# EAGLE design main (EAGLE 9.1.1)
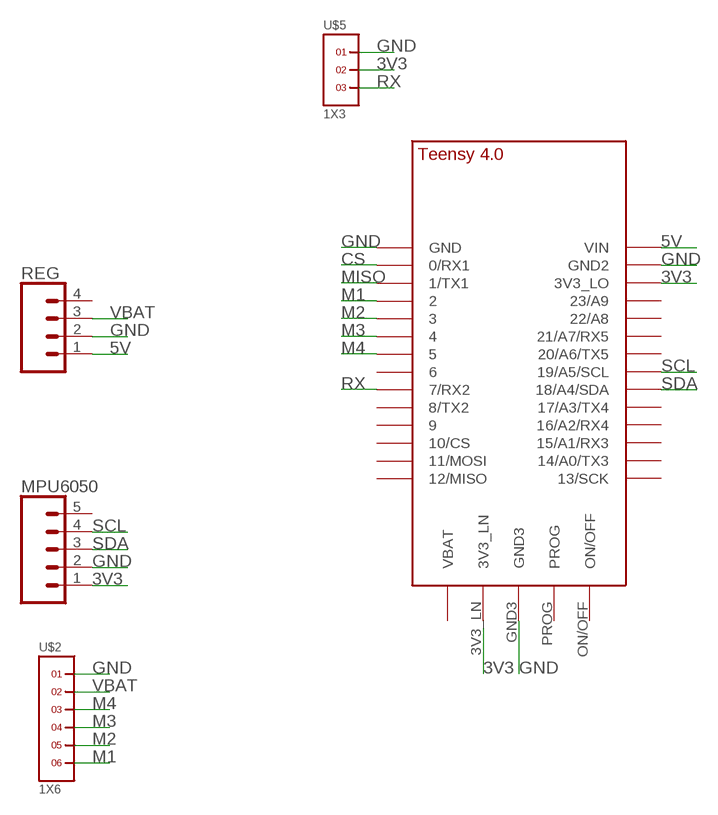
[diagram p0: schematic, sheet 1]

## Parts
MPU6050  CONN_05NO_SILK  [1X05_NO_SILK]
REG  CONN_041X04_NO_SILK  [1X04_NO_SILK]
U$1  TEENSY_4.0  [TEENSY_4.0]
U$2  1X6  [1X6]
U$5  1X3  [1X3]

## Nets
3V3: MPU6050.1 U$1.3V3_LN U$1.3V3_LO U$5.2
5V: REG.1 U$1.VIN
CS: U$1.0/RX(0/RX1)
GND: MPU6050.2 REG.2 U$1.GND U$1.GND2 U$1.GND3 U$2.1 U$5.1
M1: U$1.2 U$2.6
M2: U$1.3/CANTX U$2.5
M3: U$1.4/CANRX U$2.4
M4: U$1.5 U$2.3
MISO: U$1.1/TX(1/TX1)
RX: U$1.7(7/RX2) U$5.3
SCL: MPU6050.4 U$1.19/A5/SCL
SDA: MPU6050.3 U$1.18/A4/SDA
VBAT: REG.3 U$2.2
Unconnected: MPU6050.5 REG.4 U$1.6 U$1.8(8/TX2) U$1.9/CS U$1.10/CS U$1.11/MOSI U$1.12/MISO U$1.13/SCK U$1.14/A0(14/A0/TX3) U$1.15/A1(15/A1/RX3) U$1.16/A2(16/A2/RX4) U$1.17/A3(17/A3/TX4) U$1.20/A6(20/A6/TX5) U$1.21/A7(21/A7/RX5) U$1.22/A8 U$1.23/A9 U$1.ON/OFF U$1.PROG U$1.VBAT\(VBAT)

## Library data of the parts
MPU6050 = SparkFun-Connectors:CONN_05: Multi connection point. Often used as Generic Header-pin footprint for 0.1 inch spaced/style header connections On any of the 0.1 inch spaced packages, you can populate with these: Break Away Headers - Straight <https://www.sparkfun.com/products/116> (PRT-00116) Break Away Male Headers - Right Angle <https://www.sparkfun.com/products/553> (PRT-00553) Female Headers <https://www.sparkfun.com/products/115> (PRT-00115) Break Away Headers - Machine Pin <https://www.sparkfun.com/products/117> (PRT-00117) Break Away Female Headers - Swiss Machine Pin <https://www.sparkfun.com/products/743> (PRT-00743) For SCREWTERMINALS and SPRING TERMINALS visit here: Screw Terimnals on SparkFun.com <https://www.sparkfun.com/search/results?term=Screw+Terminals> (5mm/3.5mm/2.54mm spacing) This device is also useful as a general connection point to wire up your design to another part of your project. Our various solder wires solder well into these plated through hole pads. Hook-Up Wire - Assortment (Stranded, 22 AWG) <https://www.sparkfun.com/products/11375> (PRT-11375) Hook-Up Wire - Assortment (Solid Core, 22 AWG) <https://www.sparkfun.com/products/11367> (PRT-11367) View the entire wire category on our website here <https://www.sparkfun.com/categories/141> Special notes: Molex polarized connector foot print use with SKU : PRT-08231 with associated crimp pins and housings. 1MM SMD Version SKU: PRT-10208
REG = SparkFun-Connectors:CONN_04: Multi connection point. Often used as Generic Header-pin footprint for 0.1 inch spaced/style header connections On any of the 0.1 inch spaced packages, you can populate with these: Break Away Headers - Straight <https://www.sparkfun.com/products/116> (PRT-00116) Break Away Male Headers - Right Angle <https://www.sparkfun.com/products/553> (PRT-00553) Female Headers <https://www.sparkfun.com/products/115> (PRT-00115) Break Away Headers - Machine Pin <https://www.sparkfun.com/products/117> (PRT-00117) Break Away Female Headers - Swiss Machine Pin <https://www.sparkfun.com/products/743> (PRT-00743) For SCREWTERMINALS and SPRING TERMINALS visit here: Screw Terimnals on SparkFun.com <https://www.sparkfun.com/search/results?term=Screw+Terminals> (5mm/3.5mm/2.54mm spacing) This device is also useful as a general connection point to wire up your design to another part of your project. Our various solder wires solder well into these plated through hole pads. Hook-Up Wire - Assortment (Stranded, 22 AWG) <https://www.sparkfun.com/products/11375> (PRT-11375) Hook-Up Wire - Assortment (Solid Core, 22 AWG) <https://www.sparkfun.com/products/11367> (PRT-11367) View the entire wire category on our website here <https://www.sparkfun.com/categories/141> Special notes: Molex polarized connector foot print use with SKU : PRT-08231 with associated crimp pins and housings. 1MM SMD Version SKU: PRT-10208; PROD_ID: CONN-09696
U$1 = TEENSY 4.0:TEENSY_4.0
U$2 = headers(2mm):1X6
U$5 = headers(2mm):1X3

## Board
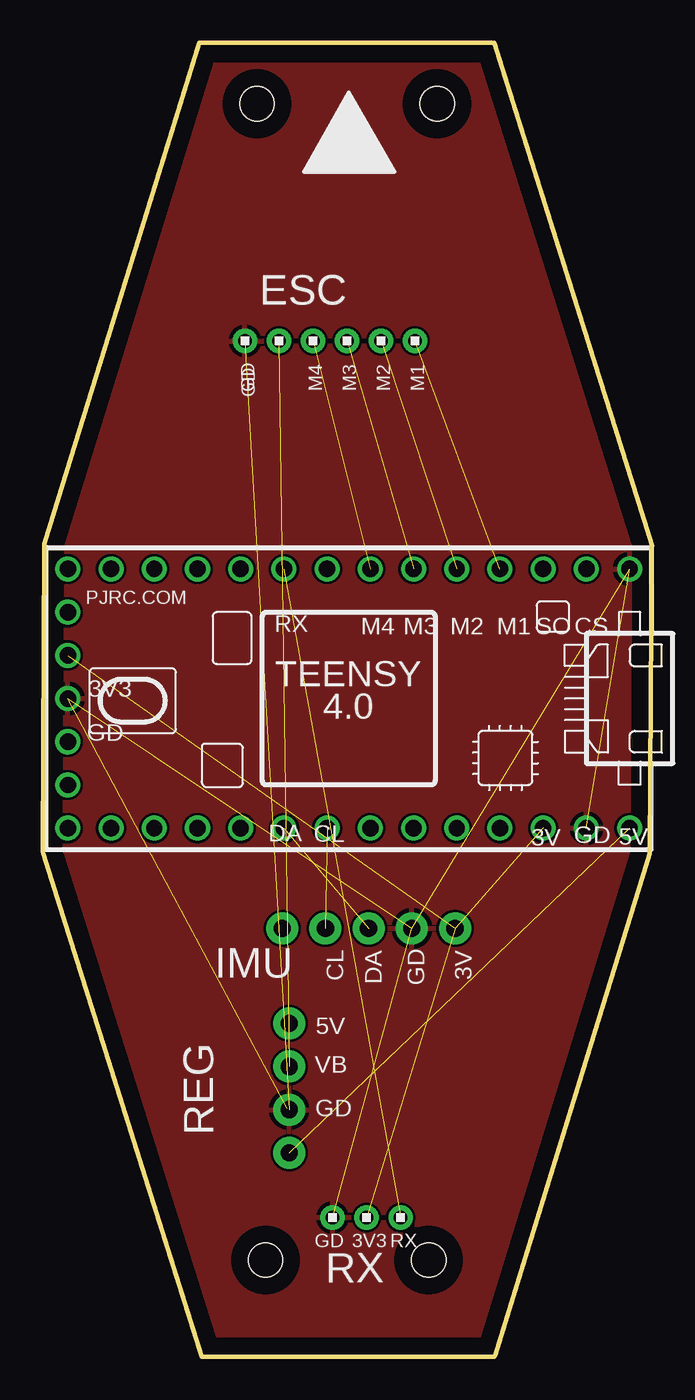
[diagram p1: board, top side]

Size 35.85 x 77.3 mm. Coordinates in mm from the lower left corner, seen from the top.
Outline: 26.4,77.3 9.2,77.3 0.1,47.8 0,29.7
Outline: 26.55,0 9.35,0 0.05,29.6
Outline: 26.55,77.3 35.85,47.7
Outline: 35.8,47.7 35.7,29.6 26.6,0.1
Copper layers (1*16): Top 0.035mm / dielectric 1.5mm / Bottom 0.035mm
Design rules "default": minimum track width 6mil, minimum drill 0.35mm, track to track 6mil, track to pad 6mil, pad to pad 6mil, via to via 6mil, smd to smd 6mil, copper to edge 40mil, drill to drill 6mil, minimum pad ring 10mil, minimum via ring 8mil, stop-mask expansion 4mil, vias tented up to drill 0mil, thermal gap 10mil
Holes 2 mm at 12.6,73.7 23.2,73.7 13.1,5.7 22.7,5.7

### Footprints (pad centres in the part's own frame; a part is rotated, then mirrored left to right if it is on the bottom)
1X05_NO_SILK = drill 1.016 pad 1.88: 1 0,0; 2 2.54,0; 3 5.08,0; 4 7.62,0; 5 10.16,0
1X04_NO_SILK = drill 1.016 pad 1.88: 1 0,0; 2 2.54,0; 3 5.08,0; 4 7.62,0
TEENSY_4.0 = drill 0.965: 0/RX -13.97,-7.62; 1/TX -11.43,-7.62; 2 -8.89,-7.62; 3/CANTX -6.35,-7.62; 3V3_LN 16.51,-2.54; 3V3_LO -11.43,7.62; 4/CANRX -3.81,-7.62; 5 -1.27,-7.62; 6 1.27,-7.62; 7 3.81,-7.62; 8 6.35,-7.62; 9/CS 8.89,-7.62; 10/CS 11.43,-7.62; 11/MOSI 13.97,-7.62; 12/MISO 16.51,-7.62; 13/SCK 16.51,7.62; 14/A0 13.97,7.62; 15/A1 11.43,7.62; 16/A2 8.89,7.62; 17/A3 6.35,7.62; 18/A4/SDA 3.81,7.62; 19/A5/SCL 1.27,7.62; 20/A6 -1.27,7.62; 21/A7 -3.81,7.62; 22/A8 -6.35,7.62; 23/A9 -8.89,7.62; GND -16.51,-7.62; GND2 -13.97,7.62; GND3 16.51,0; ON/OFF 16.51,5.08; PROG 16.51,2.54; VBAT\ 16.51,-5.08; VIN -16.51,7.62
1X6 = drill 0.8 pad 1.422: 1 -5,0; 2 -3,0; 3 -1,0; 4 1,0; 5 3,0; 6 5,0
1X3 = drill 0.8 pad 1.422: 1 -2,0; 2 0,0; 3 2,0

### Placement (x,y rotation side)
MPU6050  24.25,25.2 180 top
REG  14.5,12 90 top
U$1  18,38.72 180 top
U$2  16.9,59.75 0 top
U$5  19.05,8.2 0 top

### Tracks (layer width: path | path; a pad name or v marks a point on that pad's centre or on a via)
3V3  (3 unrouted)
5V  (1 unrouted)
GND  (6 unrouted)
  Top 0.305: 14.4,14.63 REG.2
  pour Top: 41.25,80.06 41.25,-1.45 -5.5,-1.45 -5.5,80.06
M1  (1 unrouted)
M2  (1 unrouted)
M3  (1 unrouted)
M4  (1 unrouted)
RX  (1 unrouted)
SCL  (1 unrouted)
SDA  (1 unrouted)
VBAT  (1 unrouted)

### Text on the board
tNames: ESC | GD | M4 | M3 | M2 | M1 | GD | RX | M4 | M3 | M2 | M1 | SO | CS | 3V3 | GD | DA | CL | 3V | GD | 5V | CL | DA | GD | 3V | IMU | 5V | VB | GD | REG | GD | 3V3 | RX | RX
bNames: VB | M4 | M3 | M2 | M1 | RX | 3V3 | GD | GD | 3V3 | RX